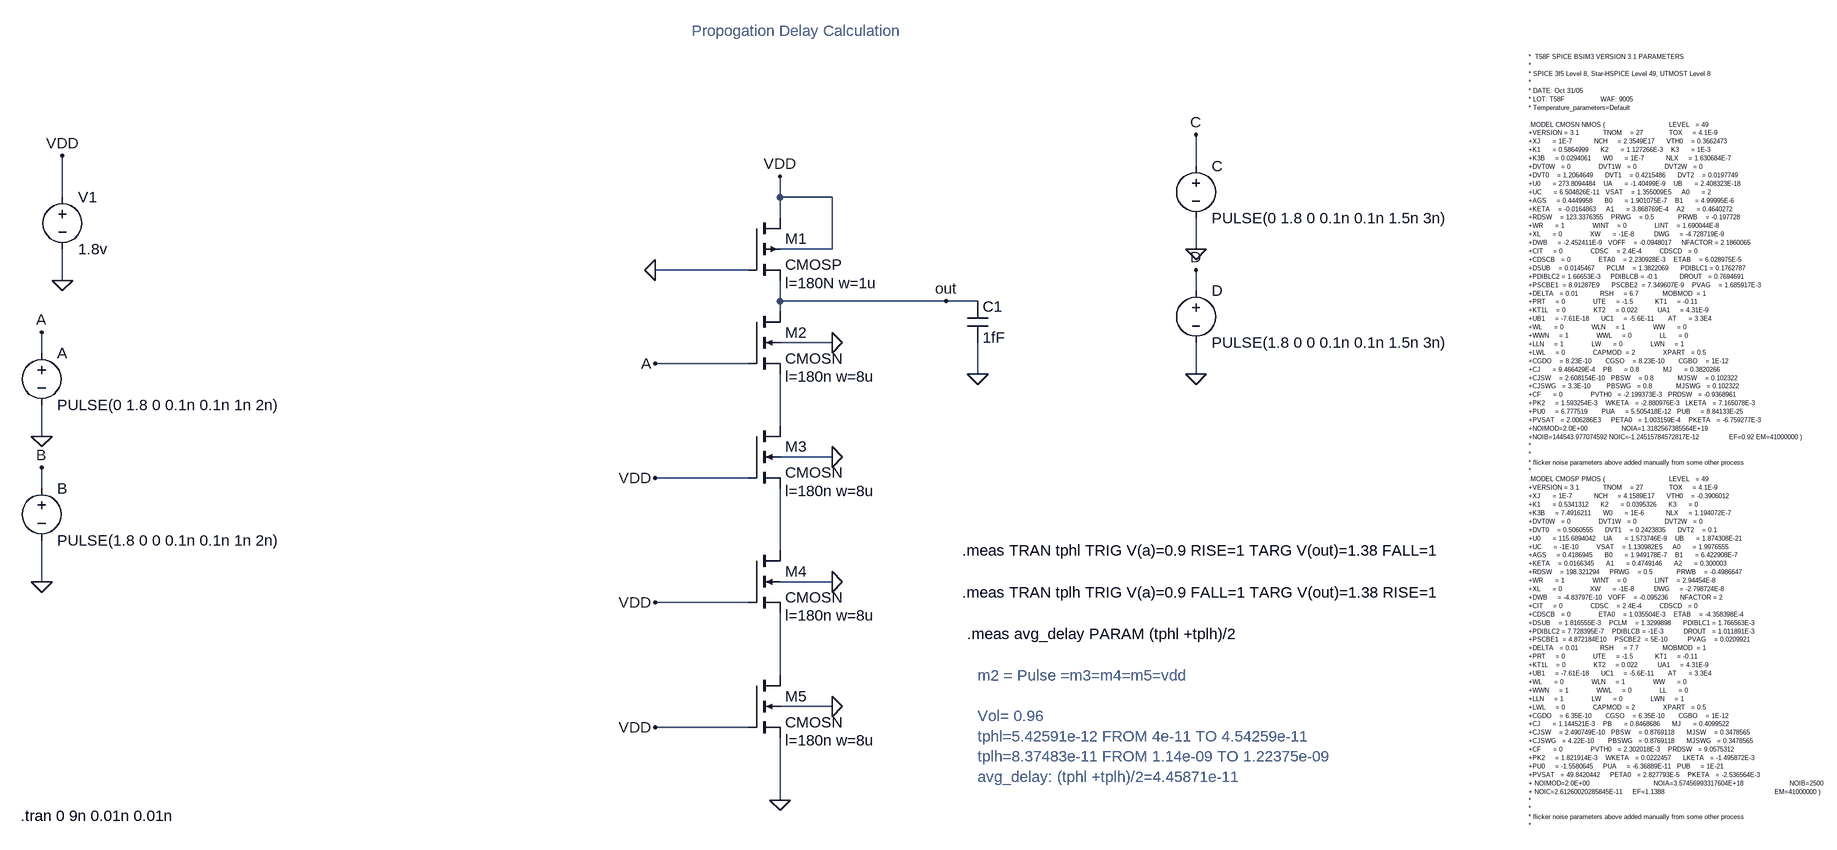
[diagram p0: schematic nand gate propogation delay calculation M2 on.asc]
nand gate propogation delay calculation M2 on.asc, the LTspice schematic file:
Version 4
SHEET 1 1852 1152
WIRE 864 -32 864 -80
WIRE -880 16 -880 -48
WIRE 224 16 224 -16
WIRE 304 16 224 16
WIRE 224 48 224 16
WIRE 304 96 304 16
WIRE 304 96 224 96
WIRE 864 96 864 48
WIRE 176 128 32 128
WIRE -880 144 -880 96
WIRE 864 160 864 128
WIRE 224 176 224 144
WIRE 480 176 224 176
WIRE 528 176 480 176
WIRE 224 192 224 176
WIRE 304 240 224 240
WIRE -912 256 -912 224
WIRE 176 272 32 272
WIRE 528 288 528 240
WIRE 864 288 864 240
WIRE 224 368 224 288
WIRE -912 384 -912 336
WIRE 304 416 224 416
WIRE 176 448 32 448
WIRE -912 464 -912 432
WIRE 224 560 224 464
WIRE -912 608 -912 544
WIRE 304 608 224 608
WIRE 176 640 32 640
WIRE 224 752 224 656
WIRE 304 800 224 800
WIRE 176 832 32 832
WIRE 224 944 224 848
FLAG 224 944 0
FLAG -880 144 0
FLAG -880 -48 VDD
FLAG 224 -16 VDD
FLAG 32 128 0
FLAG -912 384 0
FLAG -912 608 0
FLAG 304 240 0
FLAG 304 416 0
FLAG 304 608 0
FLAG 304 800 0
FLAG 864 96 0
FLAG 864 288 0
FLAG -912 224 A
FLAG -912 432 B
FLAG 864 -80 C
FLAG 864 128 D
FLAG 528 288 0
FLAG 480 176 out
FLAG 32 272 A
FLAG 32 448 VDD
FLAG 32 640 VDD
FLAG 32 832 VDD
DATAFLAG 80 272 ""
DATAFLAG 80 272 ""
SYMBOL pmos4 176 48 R0
WINDOW 123 56 100 Left 2
SYMATTR Value2 l=180N w=1u
SYMATTR InstName M1
SYMATTR Value CMOSP
SYMBOL nmos4 176 192 R0
WINDOW 123 56 100 Left 2
SYMATTR Value2 l=180n w=8u
SYMATTR InstName M2
SYMATTR Value CMOSN
SYMBOL nmos4 176 368 R0
WINDOW 123 56 100 Left 2
SYMATTR Value2 l=180n w=8u
SYMATTR InstName M3
SYMATTR Value CMOSN
SYMBOL nmos4 176 560 R0
WINDOW 123 56 100 Left 2
SYMATTR Value2 l=180n w=8u
SYMATTR InstName M4
SYMATTR Value CMOSN
SYMBOL nmos4 176 752 R0
WINDOW 123 56 100 Left 2
SYMATTR Value2 l=180n w=8u
SYMATTR InstName M5
SYMATTR Value CMOSN
SYMBOL voltage -880 0 R0
WINDOW 123 0 0 Left 0
WINDOW 39 0 0 Left 0
SYMATTR InstName V1
SYMATTR Value 1.8v
SYMBOL voltage -912 448 R0
WINDOW 123 0 0 Left 0
WINDOW 39 0 0 Left 0
SYMATTR InstName B
SYMATTR Value PULSE(1.8 0 0 0.1n 0.1n 1n 2n)
SYMBOL voltage 864 144 R0
WINDOW 123 0 0 Left 0
WINDOW 39 0 0 Left 0
SYMATTR InstName D
SYMATTR Value PULSE(1.8 0 0 0.1n 0.1n 1.5n 3n)
SYMBOL voltage 864 -48 R0
WINDOW 123 0 0 Left 0
WINDOW 39 0 0 Left 0
SYMATTR InstName C
SYMATTR Value PULSE(0 1.8 0 0.1n 0.1n 1.5n 3n)
SYMBOL voltage -912 240 R0
WINDOW 123 0 0 Left 0
WINDOW 39 0 0 Left 0
SYMATTR InstName A
SYMATTR Value PULSE(0 1.8 0 0.1n 0.1n 1n 2n)
SYMBOL cap 512 176 R0
SYMATTR InstName C1
SYMATTR Value 1fF
TEXT -944 968 Left 2 !.tran 0 9n 0.01n 0.01n
TEXT 1376 -200 Left 0 !*  T58F SPICE BSIM3 VERSION 3.1 PARAMETERS\n* \n* SPICE 3f5 Level 8, Star-HSPICE Level 49, UTMOST Level 8\n* \n* DATE: Oct 31/05\n* LOT: T58F                  WAF: 9005\n* Temperature_parameters=Default\n \n.MODEL CMOSN NMOS (                                LEVEL   = 49\n+VERSION = 3.1            TNOM    = 27             TOX     = 4.1E-9\n+XJ      = 1E-7           NCH     = 2.3549E17      VTH0    = 0.3662473\n+K1      = 0.5864999      K2      = 1.127266E-3    K3      = 1E-3\n+K3B     = 0.0294061      W0      = 1E-7           NLX     = 1.630684E-7\n+DVT0W   = 0              DVT1W   = 0              DVT2W   = 0\n+DVT0    = 1.2064649      DVT1    = 0.4215486      DVT2    = 0.0197749\n+U0      = 273.8094484    UA      = -1.40499E-9    UB      = 2.408323E-18\n+UC      = 6.504826E-11   VSAT    = 1.355009E5     A0      = 2\n+AGS     = 0.4449958      B0      = 1.901075E-7    B1      = 4.99995E-6\n+KETA    = -0.0164863     A1      = 3.868769E-4    A2      = 0.4640272\n+RDSW    = 123.3376355    PRWG    = 0.5            PRWB    = -0.197728\n+WR      = 1              WINT    = 0              LINT    = 1.690044E-8\n+XL      = 0              XW      = -1E-8          DWG     = -4.728719E-9\n+DWB     = -2.452411E-9   VOFF    = -0.0948017     NFACTOR = 2.1860065\n+CIT     = 0              CDSC    = 2.4E-4         CDSCD   = 0\n+CDSCB   = 0              ETA0    = 2.230928E-3    ETAB    = 6.028975E-5\n+DSUB    = 0.0145467      PCLM    = 1.3822069      PDIBLC1 = 0.1762787\n+PDIBLC2 = 1.66653E-3     PDIBLCB = -0.1           DROUT   = 0.7694691\n+PSCBE1  = 8.91287E9      PSCBE2  = 7.349607E-9    PVAG    = 1.685917E-3\n+DELTA   = 0.01           RSH     = 6.7            MOBMOD  = 1\n+PRT     = 0              UTE     = -1.5           KT1     = -0.11\n+KT1L    = 0              KT2     = 0.022          UA1     = 4.31E-9\n+UB1     = -7.61E-18      UC1     = -5.6E-11       AT      = 3.3E4\n+WL      = 0              WLN     = 1              WW      = 0\n+WWN     = 1              WWL     = 0              LL      = 0\n+LLN     = 1              LW      = 0              LWN     = 1\n+LWL     = 0              CAPMOD  = 2              XPART   = 0.5\n+CGDO    = 8.23E-10       CGSO    = 8.23E-10       CGBO    = 1E-12\n+CJ      = 9.466429E-4    PB      = 0.8            MJ      = 0.3820266\n+CJSW    = 2.608154E-10   PBSW    = 0.8            MJSW    = 0.102322\n+CJSWG   = 3.3E-10        PBSWG   = 0.8            MJSWG   = 0.102322\n+CF      = 0              PVTH0   = -2.199373E-3   PRDSW   = -0.9368961\n+PK2     = 1.593254E-3    WKETA   = -2.880976E-3   LKETA   = 7.165078E-3\n+PU0     = 6.777519       PUA     = 5.505418E-12   PUB     = 8.84133E-25\n+PVSAT   = 2.006286E3     PETA0   = 1.003159E-4    PKETA   = -6.759277E-3\n+NOIMOD=2.0E+00                 NOIA=1.3182567385564E+19\n+NOIB=144543.977074592 NOIC=-1.24515784572817E-12               EF=0.92 EM=41000000 )\n*\n*\n* flicker noise parameters above added manually from some other process\n* \n.MODEL CMOSP PMOS (                                LEVEL   = 49\n+VERSION = 3.1            TNOM    = 27             TOX     = 4.1E-9\n+XJ      = 1E-7           NCH     = 4.1589E17      VTH0    = -0.3906012\n+K1      = 0.5341312      K2      = 0.0395326      K3      = 0\n+K3B     = 7.4916211      W0      = 1E-6           NLX     = 1.194072E-7\n+DVT0W   = 0              DVT1W   = 0              DVT2W   = 0\n+DVT0    = 0.5060555      DVT1    = 0.2423835      DVT2    = 0.1\n+U0      = 115.6894042    UA      = 1.573746E-9    UB      = 1.874308E-21\n+UC      = -1E-10         VSAT    = 1.130982E5     A0      = 1.9976555\n+AGS     = 0.4186945      B0      = 1.949178E-7    B1      = 6.422908E-7\n+KETA    = 0.0166345      A1      = 0.4749146      A2      = 0.300003\n+RDSW    = 198.321294     PRWG    = 0.5            PRWB    = -0.4986647\n+WR      = 1              WINT    = 0              LINT    = 2.94454E-8\n+XL      = 0              XW      = -1E-8          DWG     = -2.798724E-8\n+DWB     = -4.83797E-10   VOFF    = -0.095236      NFACTOR = 2\n+CIT     = 0              CDSC    = 2.4E-4         CDSCD   = 0\n+CDSCB   = 0              ETA0    = 1.035504E-3    ETAB    = -4.358398E-4\n+DSUB    = 1.816555E-3    PCLM    = 1.3299898      PDIBLC1 = 1.766563E-3\n+PDIBLC2 = 7.728395E-7    PDIBLCB = -1E-3          DROUT   = 1.011891E-3\n+PSCBE1  = 4.872184E10    PSCBE2  = 5E-10          PVAG    = 0.0209921\n+DELTA   = 0.01           RSH     = 7.7            MOBMOD  = 1\n+PRT     = 0              UTE     = -1.5           KT1     = -0.11\n+KT1L    = 0              KT2     = 0.022          UA1     = 4.31E-9\n+UB1     = -7.61E-18      UC1     = -5.6E-11       AT      = 3.3E4\n+WL      = 0              WLN     = 1              WW      = 0\n+WWN     = 1              WWL     = 0              LL      = 0\n+LLN     = 1              LW      = 0              LWN     = 1\n+LWL     = 0              CAPMOD  = 2              XPART   = 0.5\n+CGDO    = 6.35E-10       CGSO    = 6.35E-10       CGBO    = 1E-12\n+CJ      = 1.144521E-3    PB      = 0.8468686      MJ      = 0.4099522\n+CJSW    = 2.490749E-10   PBSW    = 0.8769118      MJSW    = 0.3478565\n+CJSWG   = 4.22E-10       PBSWG   = 0.8769118      MJSWG   = 0.3478565\n+CF      = 0              PVTH0   = 2.302018E-3    PRDSW   = 9.0575312\n+PK2     = 1.821914E-3    WKETA   = 0.0222457      LKETA   = -1.495872E-3\n+PU0     = -1.5580645     PUA     = -6.36889E-11   PUB     = 1E-21\n+PVSAT   = 49.8420442     PETA0   = 2.827793E-5    PKETA   = -2.536564E-3 \n+ NOIMOD=2.0E+00                                NOIA=3.57456993317604E+18                       NOIB=2500\n+ NOIC=2.61260020285845E-11     EF=1.1388                                                       EM=41000000 )\n*\n*\n* flicker noise parameters above added manually from some other process\n*
TEXT 88 -240 Left 2 ;Propogation Delay Calculation
TEXT 504 560 Left 2 !.meas TRAN tphl TRIG V(a)=0.9 RISE=1 TARG V(out)=1.38 FALL=1
TEXT 504 624 Left 2 !.meas TRAN tplh TRIG V(a)=0.9 FALL=1 TARG V(out)=1.38 RISE=1
TEXT 512 688 Left 2 !.meas avg_delay PARAM (tphl +tplh)/2
TEXT 528 752 Left 2 ;m2 = Pulse =m3=m4=m5=vdd\n \nVol= 0.96\ntphl=5.42591e-12 FROM 4e-11 TO 4.54259e-11\ntplh=8.37483e-11 FROM 1.14e-09 TO 1.22375e-09\navg_delay: (tphl +tplh)/2=4.45871e-11

The netlist it stands for:
* nand gate propogation delay calculation M2 on.asc
M1 VDD 0 out VDD CMOSP l=180N w=1u
M2 out A N001 0 CMOSN l=180n w=8u
M3 N001 VDD N002 0 CMOSN l=180n w=8u
M4 N002 VDD N003 0 CMOSN l=180n w=8u
M5 N003 VDD 0 0 CMOSN l=180n w=8u
V1 VDD 0 1.8v
V§B B 0 PULSE(1.8 0 0 0.1n 0.1n 1n 2n)
V§D D 0 PULSE(1.8 0 0 0.1n 0.1n 1.5n 3n)
V§C C 0 PULSE(0 1.8 0 0.1n 0.1n 1.5n 3n)
V§A A 0 PULSE(0 1.8 0 0.1n 0.1n 1n 2n)
C1 out 0 1fF
.model NMOS NMOS
.model PMOS PMOS
.lib standard.mos
.tran 0 9n 0.01n 0.01n
*  T58F SPICE BSIM3 VERSION 3.1 PARAMETERS
*
* SPICE 3f5 Level 8, Star-HSPICE Level 49, UTMOST Level 8
*
* DATE: Oct 31/05
* LOT: T58F                  WAF: 9005
* Temperature_parameters=Default
.MODEL CMOSN NMOS (                                LEVEL   = 49
+VERSION = 3.1            TNOM    = 27             TOX     = 4.1E-9
+XJ      = 1E-7           NCH     = 2.3549E17      VTH0    = 0.3662473
+K1      = 0.5864999      K2      = 1.127266E-3    K3      = 1E-3
+K3B     = 0.0294061      W0      = 1E-7           NLX     = 1.630684E-7
+DVT0W   = 0              DVT1W   = 0              DVT2W   = 0
+DVT0    = 1.2064649      DVT1    = 0.4215486      DVT2    = 0.0197749
+U0      = 273.8094484    UA      = -1.40499E-9    UB      = 2.408323E-18
+UC      = 6.504826E-11   VSAT    = 1.355009E5     A0      = 2
+AGS     = 0.4449958      B0      = 1.901075E-7    B1      = 4.99995E-6
+KETA    = -0.0164863     A1      = 3.868769E-4    A2      = 0.4640272
+RDSW    = 123.3376355    PRWG    = 0.5            PRWB    = -0.197728
+WR      = 1              WINT    = 0              LINT    = 1.690044E-8
+XL      = 0              XW      = -1E-8          DWG     = -4.728719E-9
+DWB     = -2.452411E-9   VOFF    = -0.0948017     NFACTOR = 2.1860065
+CIT     = 0              CDSC    = 2.4E-4         CDSCD   = 0
+CDSCB   = 0              ETA0    = 2.230928E-3    ETAB    = 6.028975E-5
+DSUB    = 0.0145467      PCLM    = 1.3822069      PDIBLC1 = 0.1762787
+PDIBLC2 = 1.66653E-3     PDIBLCB = -0.1           DROUT   = 0.7694691
+PSCBE1  = 8.91287E9      PSCBE2  = 7.349607E-9    PVAG    = 1.685917E-3
+DELTA   = 0.01           RSH     = 6.7            MOBMOD  = 1
+PRT     = 0              UTE     = -1.5           KT1     = -0.11
+KT1L    = 0              KT2     = 0.022          UA1     = 4.31E-9
+UB1     = -7.61E-18      UC1     = -5.6E-11       AT      = 3.3E4
+WL      = 0              WLN     = 1              WW      = 0
+WWN     = 1              WWL     = 0              LL      = 0
+LLN     = 1              LW      = 0              LWN     = 1
+LWL     = 0              CAPMOD  = 2              XPART   = 0.5
+CGDO    = 8.23E-10       CGSO    = 8.23E-10       CGBO    = 1E-12
+CJ      = 9.466429E-4    PB      = 0.8            MJ      = 0.3820266
+CJSW    = 2.608154E-10   PBSW    = 0.8            MJSW    = 0.102322
+CJSWG   = 3.3E-10        PBSWG   = 0.8            MJSWG   = 0.102322
+CF      = 0              PVTH0   = -2.199373E-3   PRDSW   = -0.9368961
+PK2     = 1.593254E-3    WKETA   = -2.880976E-3   LKETA   = 7.165078E-3
+PU0     = 6.777519       PUA     = 5.505418E-12   PUB     = 8.84133E-25
+PVSAT   = 2.006286E3     PETA0   = 1.003159E-4    PKETA   = -6.759277E-3
+NOIMOD=2.0E+00                 NOIA=1.3182567385564E+19
+NOIB=144543.977074592 NOIC=-1.24515784572817E-12               EF=0.92 EM=41000000 )
*
*
* flicker noise parameters above added manually from some other process
*
.MODEL CMOSP PMOS (                                LEVEL   = 49
+VERSION = 3.1            TNOM    = 27             TOX     = 4.1E-9
+XJ      = 1E-7           NCH     = 4.1589E17      VTH0    = -0.3906012
+K1      = 0.5341312      K2      = 0.0395326      K3      = 0
+K3B     = 7.4916211      W0      = 1E-6           NLX     = 1.194072E-7
+DVT0W   = 0              DVT1W   = 0              DVT2W   = 0
+DVT0    = 0.5060555      DVT1    = 0.2423835      DVT2    = 0.1
+U0      = 115.6894042    UA      = 1.573746E-9    UB      = 1.874308E-21
+UC      = -1E-10         VSAT    = 1.130982E5     A0      = 1.9976555
+AGS     = 0.4186945      B0      = 1.949178E-7    B1      = 6.422908E-7
+KETA    = 0.0166345      A1      = 0.4749146      A2      = 0.300003
+RDSW    = 198.321294     PRWG    = 0.5            PRWB    = -0.4986647
+WR      = 1              WINT    = 0              LINT    = 2.94454E-8
+XL      = 0              XW      = -1E-8          DWG     = -2.798724E-8
+DWB     = -4.83797E-10   VOFF    = -0.095236      NFACTOR = 2
+CIT     = 0              CDSC    = 2.4E-4         CDSCD   = 0
+CDSCB   = 0              ETA0    = 1.035504E-3    ETAB    = -4.358398E-4
+DSUB    = 1.816555E-3    PCLM    = 1.3299898      PDIBLC1 = 1.766563E-3
+PDIBLC2 = 7.728395E-7    PDIBLCB = -1E-3          DROUT   = 1.011891E-3
+PSCBE1  = 4.872184E10    PSCBE2  = 5E-10          PVAG    = 0.0209921
+DELTA   = 0.01           RSH     = 7.7            MOBMOD  = 1
+PRT     = 0              UTE     = -1.5           KT1     = -0.11
+KT1L    = 0              KT2     = 0.022          UA1     = 4.31E-9
+UB1     = -7.61E-18      UC1     = -5.6E-11       AT      = 3.3E4
+WL      = 0              WLN     = 1              WW      = 0
+WWN     = 1              WWL     = 0              LL      = 0
+LLN     = 1              LW      = 0              LWN     = 1
+LWL     = 0              CAPMOD  = 2              XPART   = 0.5
+CGDO    = 6.35E-10       CGSO    = 6.35E-10       CGBO    = 1E-12
+CJ      = 1.144521E-3    PB      = 0.8468686      MJ      = 0.4099522
+CJSW    = 2.490749E-10   PBSW    = 0.8769118      MJSW    = 0.3478565
+CJSWG   = 4.22E-10       PBSWG   = 0.8769118      MJSWG   = 0.3478565
+CF      = 0              PVTH0   = 2.302018E-3    PRDSW   = 9.0575312
+PK2     = 1.821914E-3    WKETA   = 0.0222457      LKETA   = -1.495872E-3
+PU0     = -1.5580645     PUA     = -6.36889E-11   PUB     = 1E-21
+PVSAT   = 49.8420442     PETA0   = 2.827793E-5    PKETA   = -2.536564E-3
+ NOIMOD=2.0E+00                                NOIA=3.57456993317604E+18                       NOIB=2500
+ NOIC=2.61260020285845E-11     EF=1.1388                                                       EM=41000000 )
*
*
* flicker noise parameters above added manually from some other process
*
* Propogation Delay Calculation
.meas TRAN tphl TRIG V(a)=0.9 RISE=1 TARG V(out)=1.38 FALL=1
.meas TRAN tplh TRIG V(a)=0.9 FALL=1 TARG V(out)=1.38 RISE=1
.meas avg_delay PARAM (tphl +tplh)/2
* m2 = Pulse =m3=m4=m5=vdd
* Vol= 0.96
* tphl=5.42591e-12 FROM 4e-11 TO 4.54259e-11
* tplh=8.37483e-11 FROM 1.14e-09 TO 1.22375e-09
* avg_delay: (tphl +tplh)/2=4.45871e-11
.backanno
.end

* Results of the author's LTspice run, read from the files saved beside the schematic
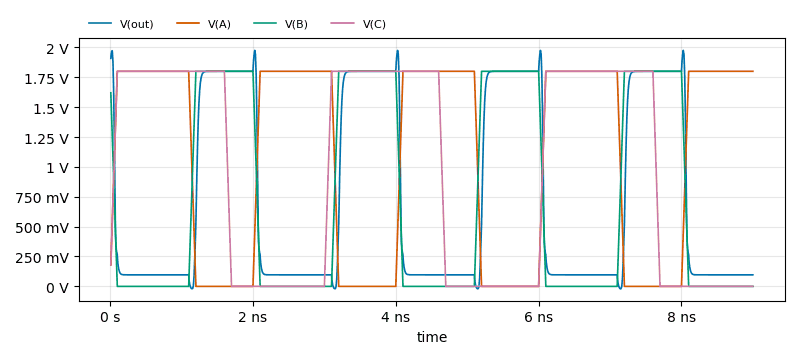
[diagram p1: Transient Analysis of nand gate propogation delay calculation M2 on.asc, plotted from the saved traces]
* Transient Analysis, 1 run:
*   V(out): min -20.33 mV, max 1.975 V, average 751.4 mV, rms 1.108 V, last 96.53 mV
*   V(A): min 0 V, max 1.8 V, average 1.071 V, rms 1.369 V, last 1.8 V
*   V(B): min 0 V, max 1.8 V, average 728.9 mV, rms 1.122 V, last 0 V
*   V(C): min 0 V, max 1.8 V, average 961 mV, rms 1.31 V, last 0 V
* From the log:
*   tphl=5.42591e-12 FROM 4e-11 TO 4.54259e-11
*   tplh=8.37483e-11 FROM 1.14e-09 TO 1.22375e-09
*   avg_delay: (tphl +tplh)/2=4.45871e-11